# Altium project ESP8266-07.PrjPcb
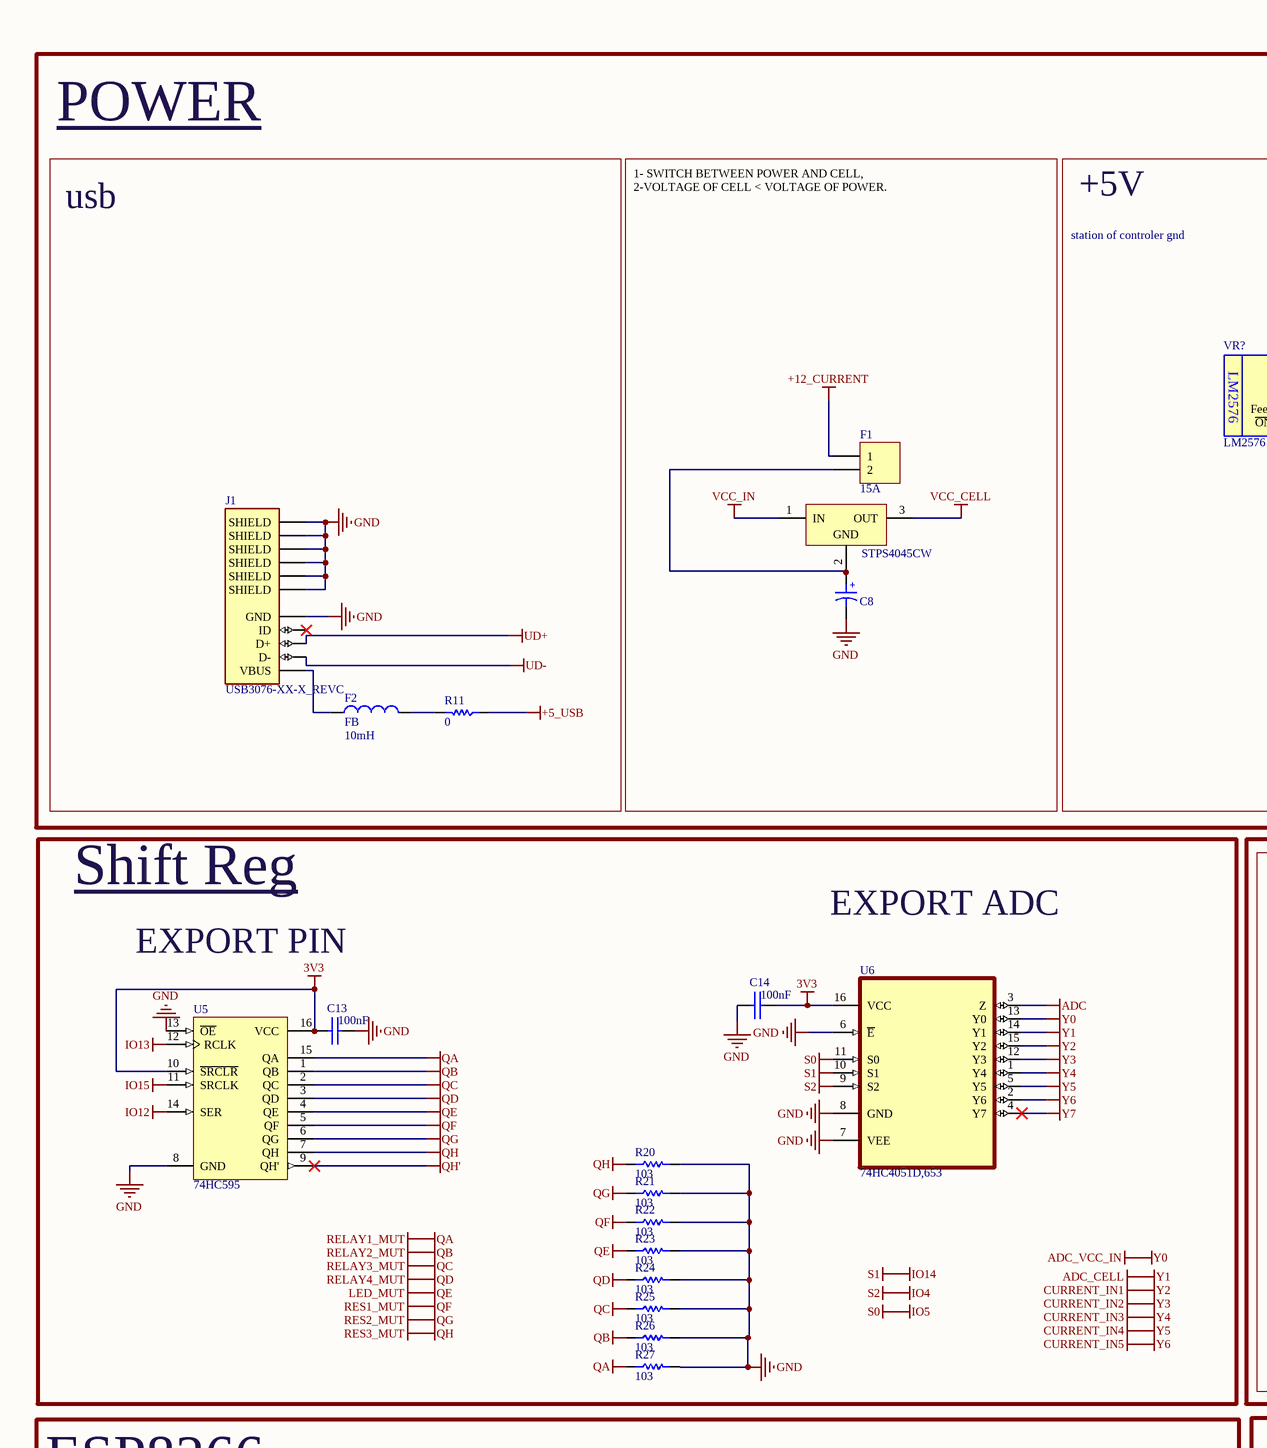
[diagram p0: ESP8266-07.SchDoc, top left]
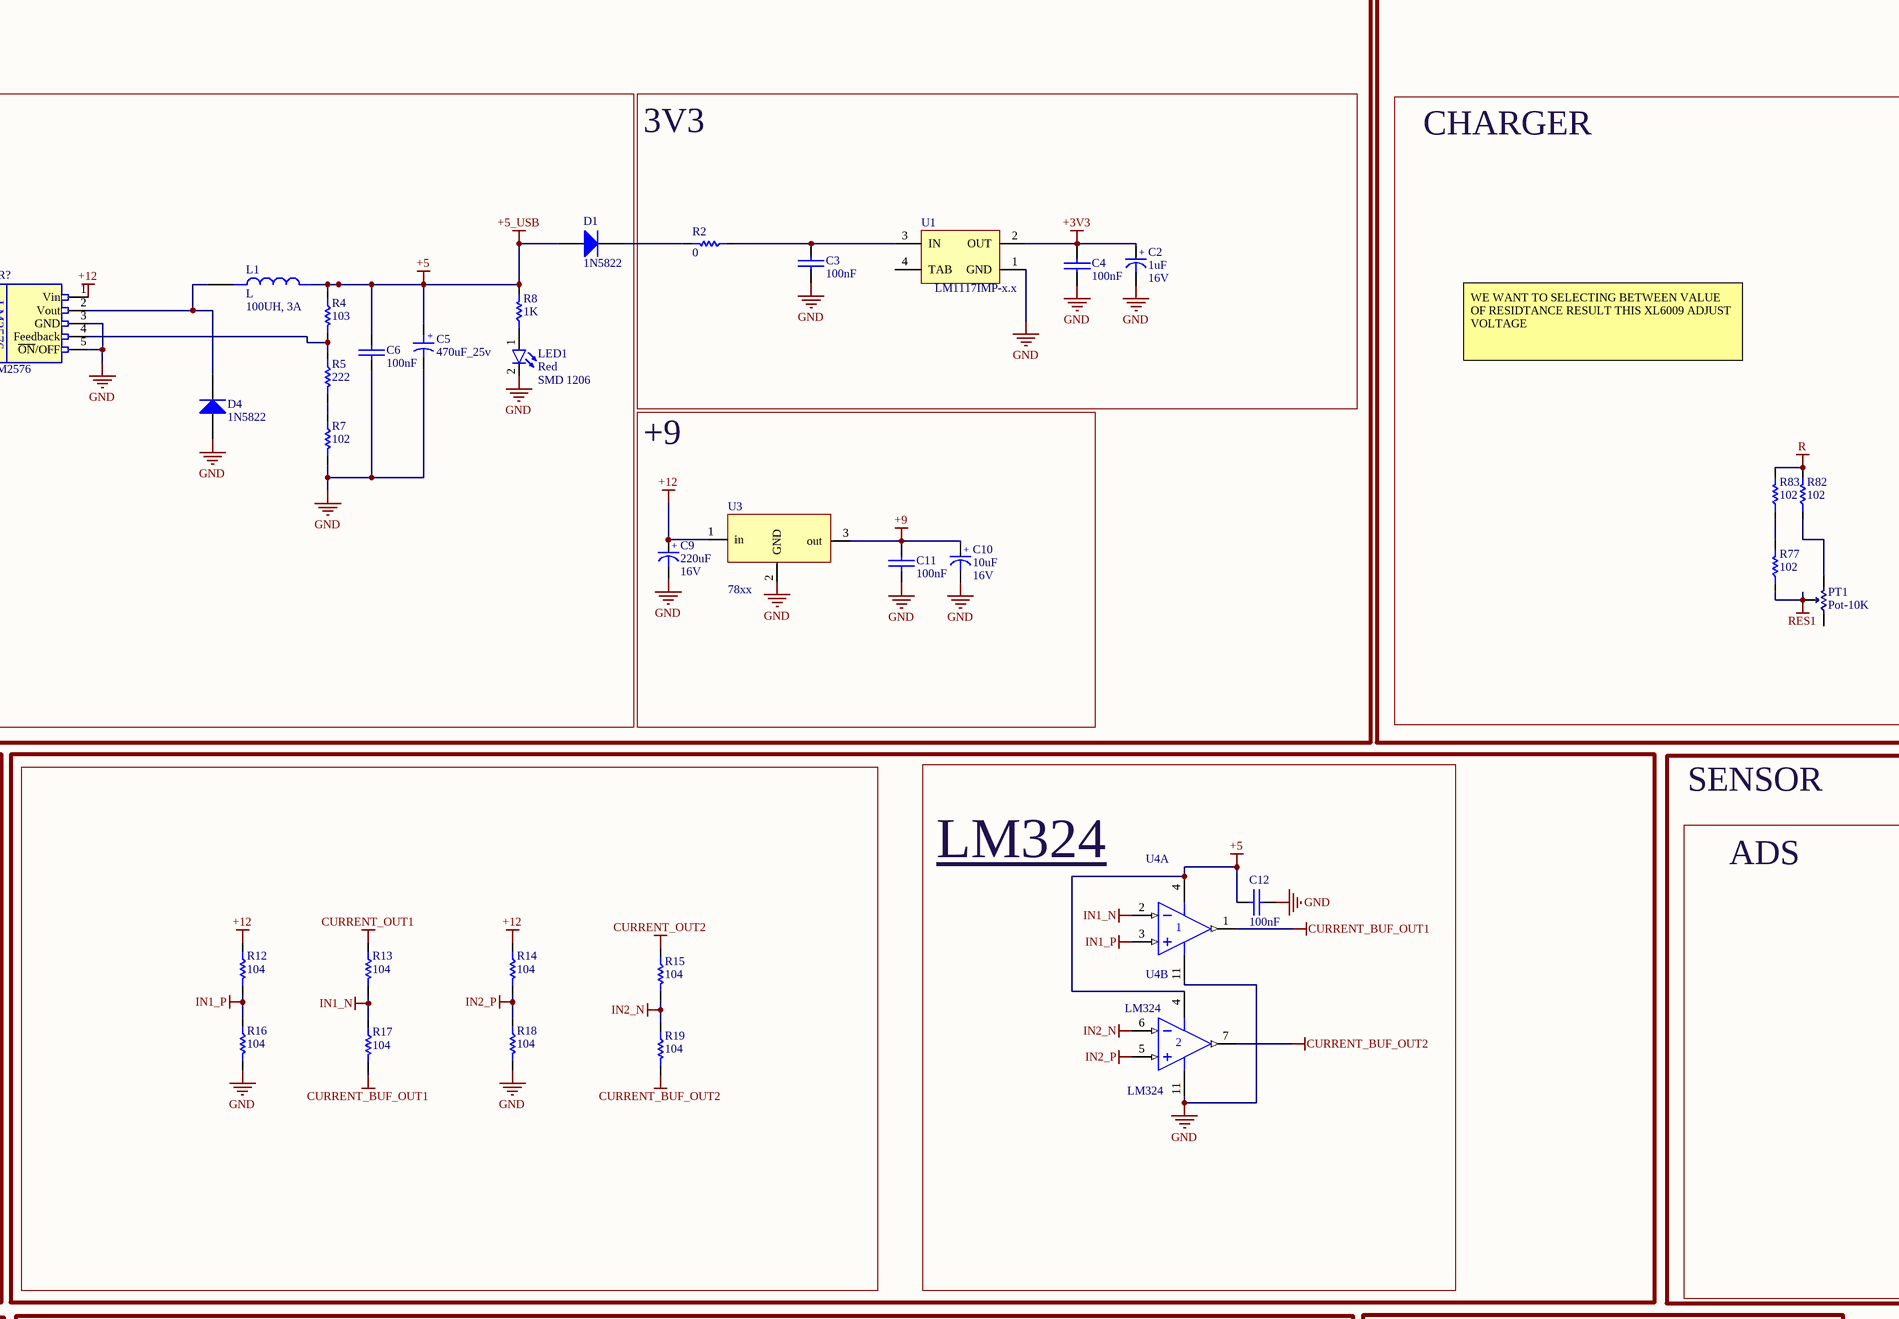
[diagram p1: ESP8266-07.SchDoc, top middle]
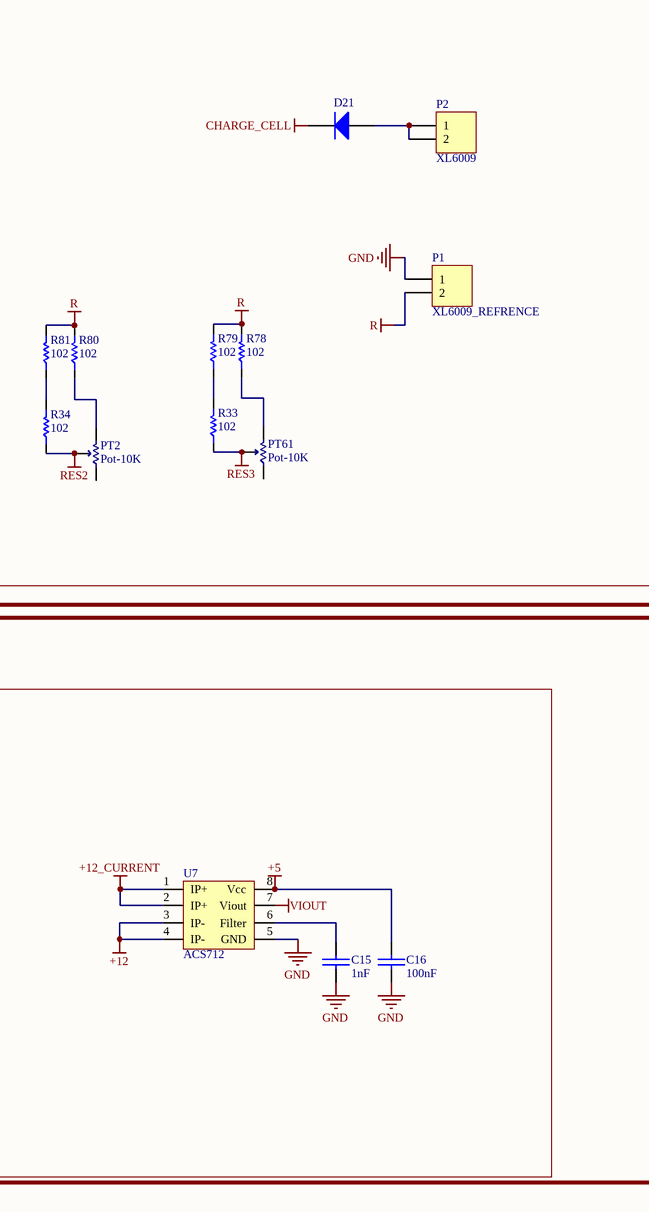
[diagram p2: ESP8266-07.SchDoc, top right]
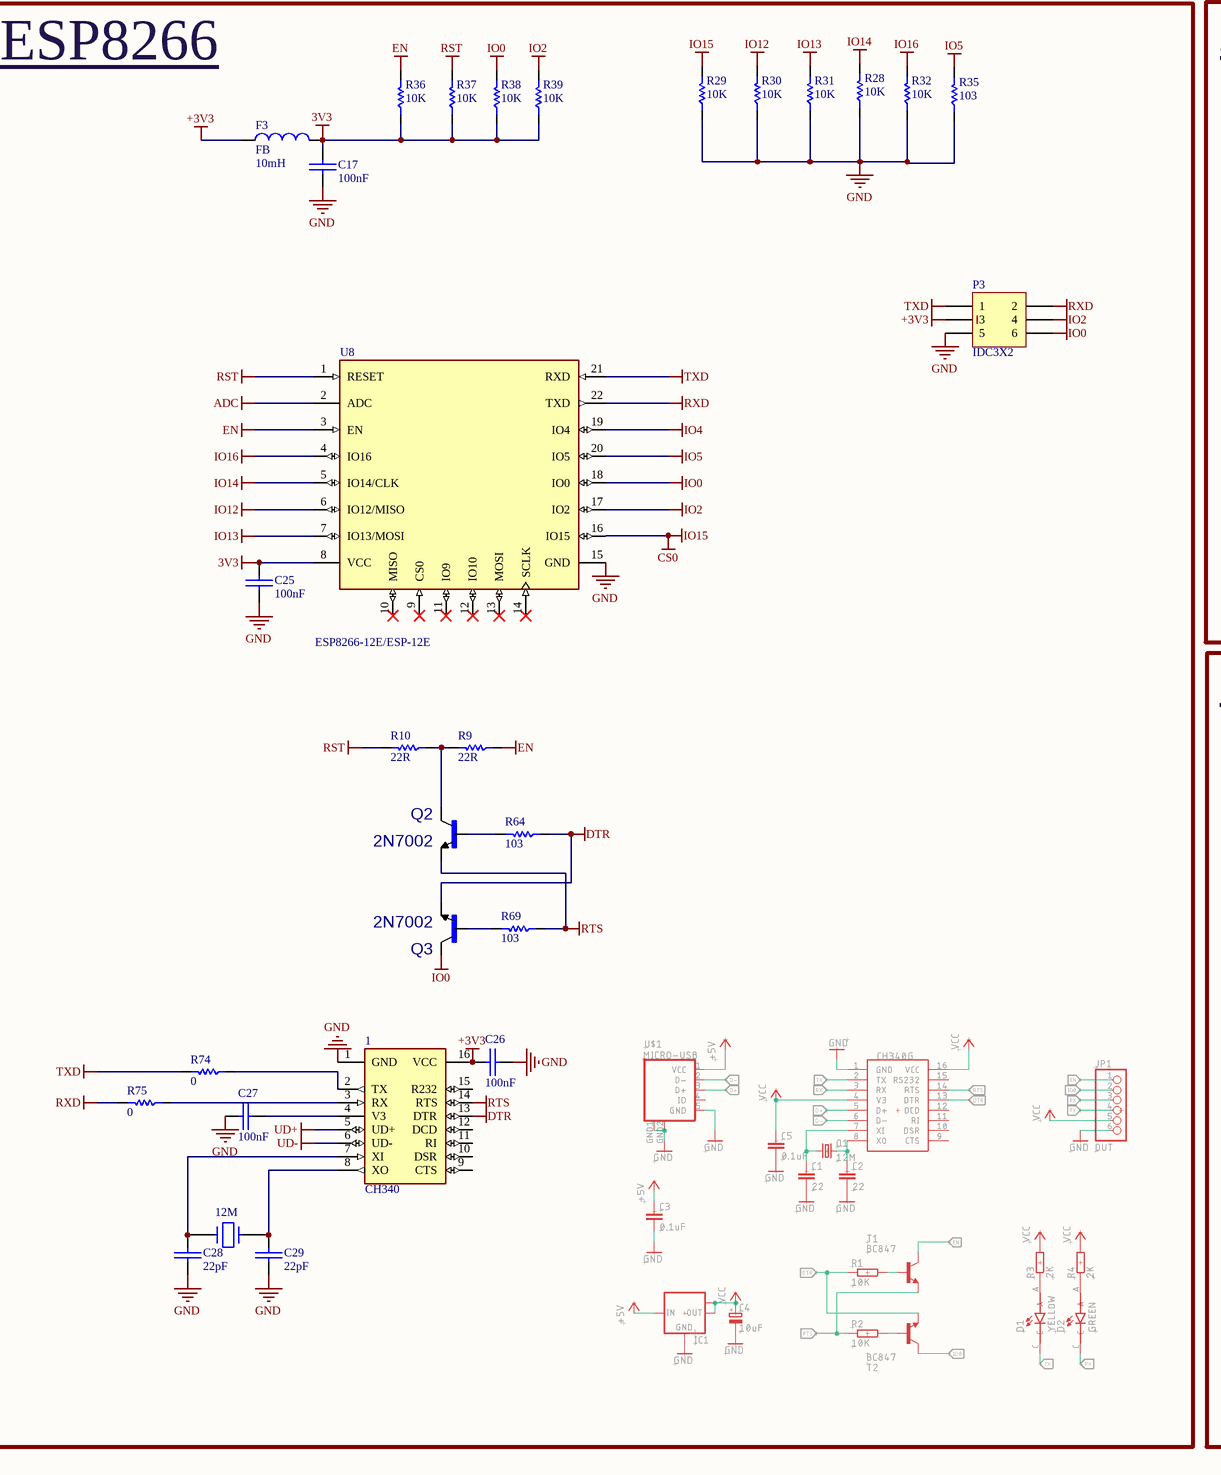
[diagram p3: ESP8266-07.SchDoc, bottom left]
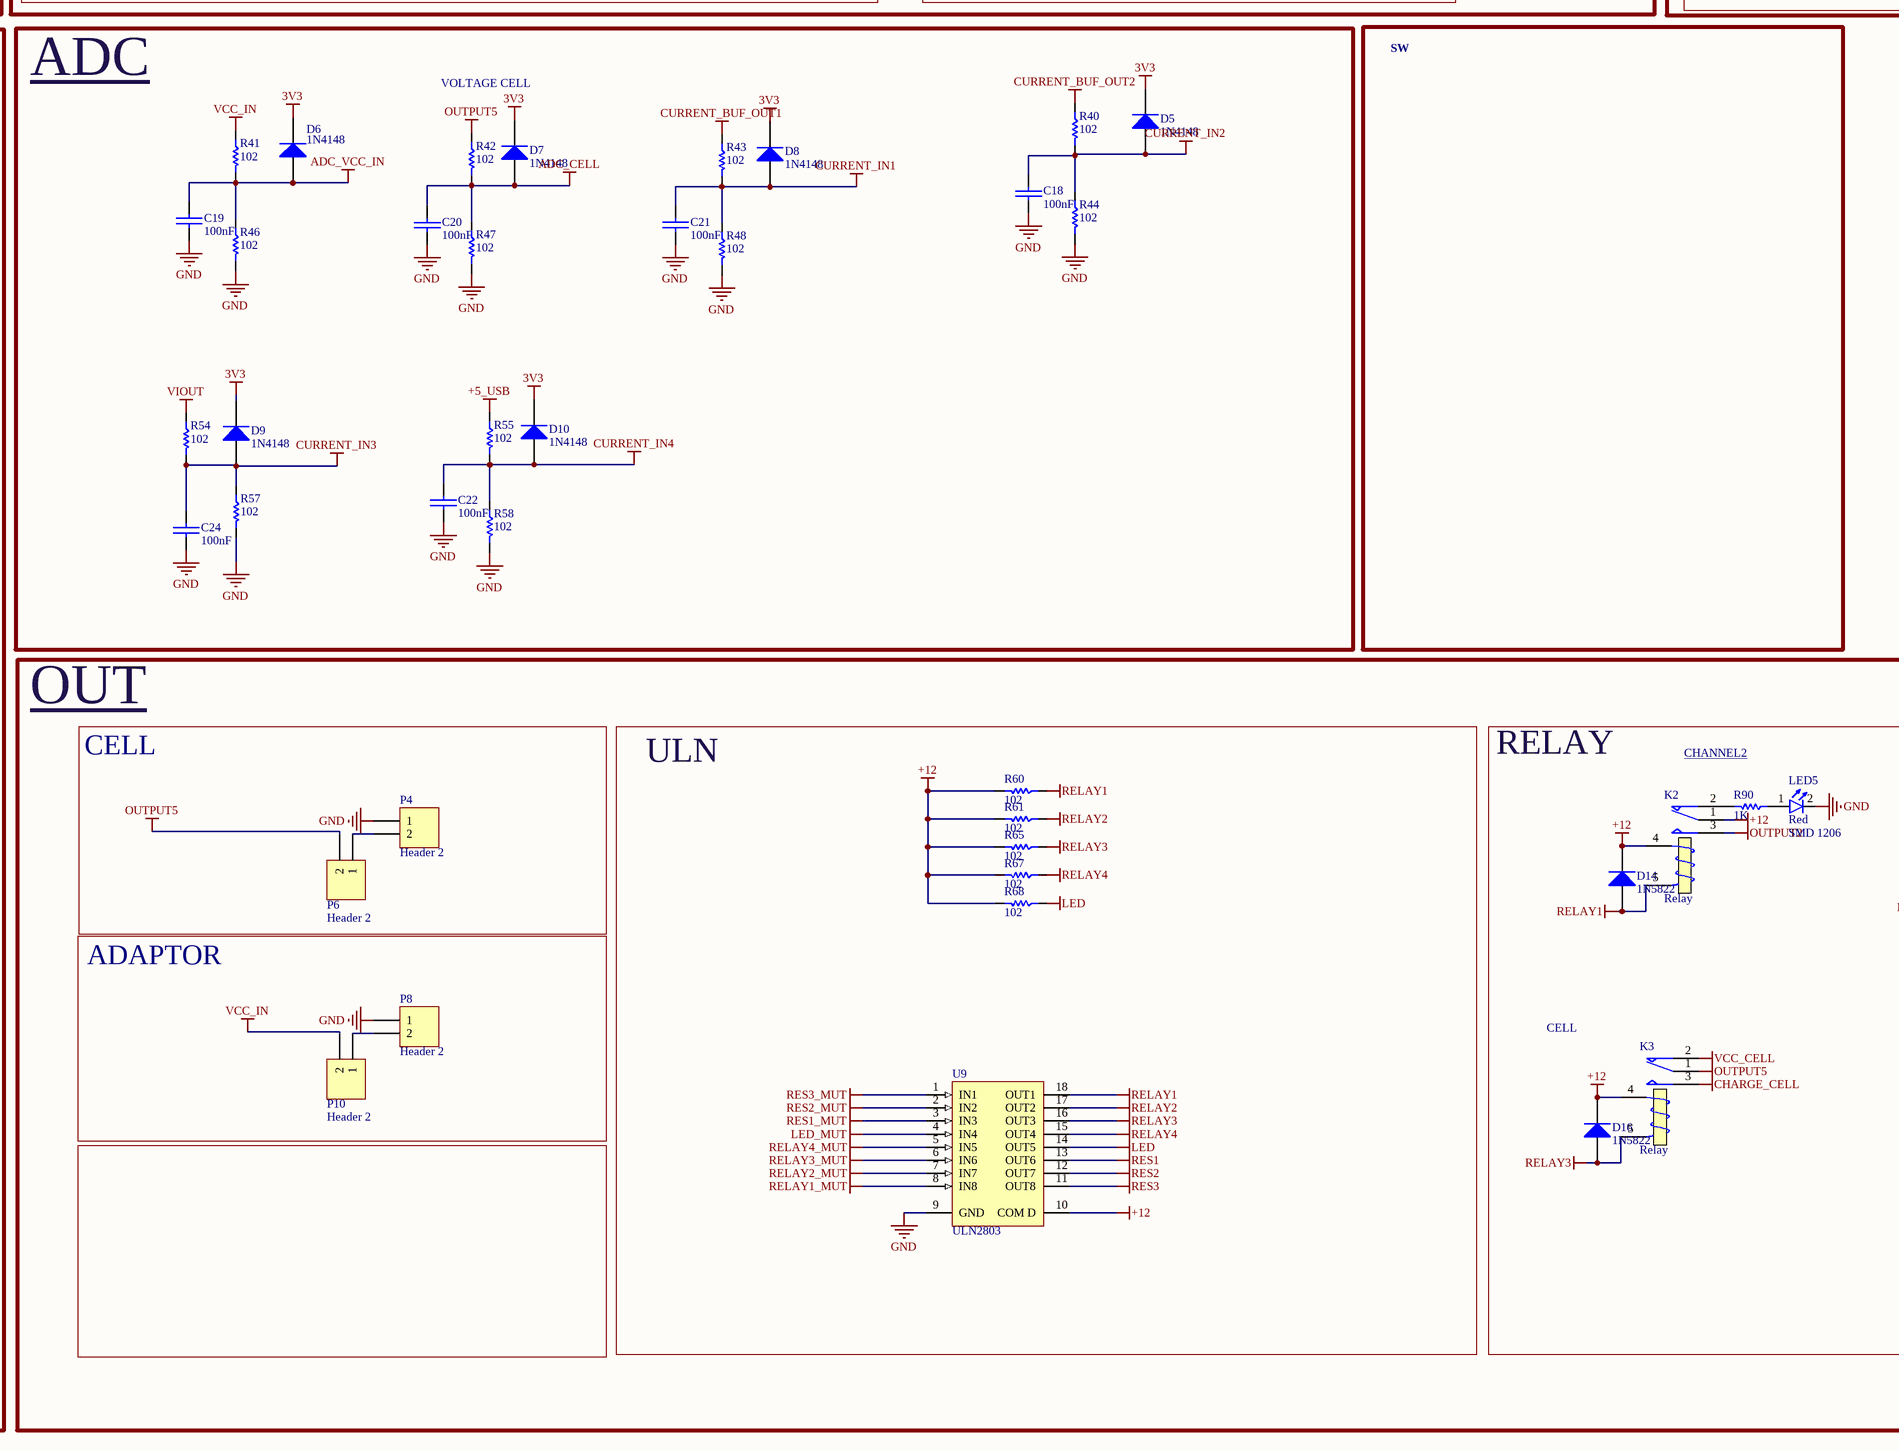
[diagram p4: ESP8266-07.SchDoc, bottom middle]
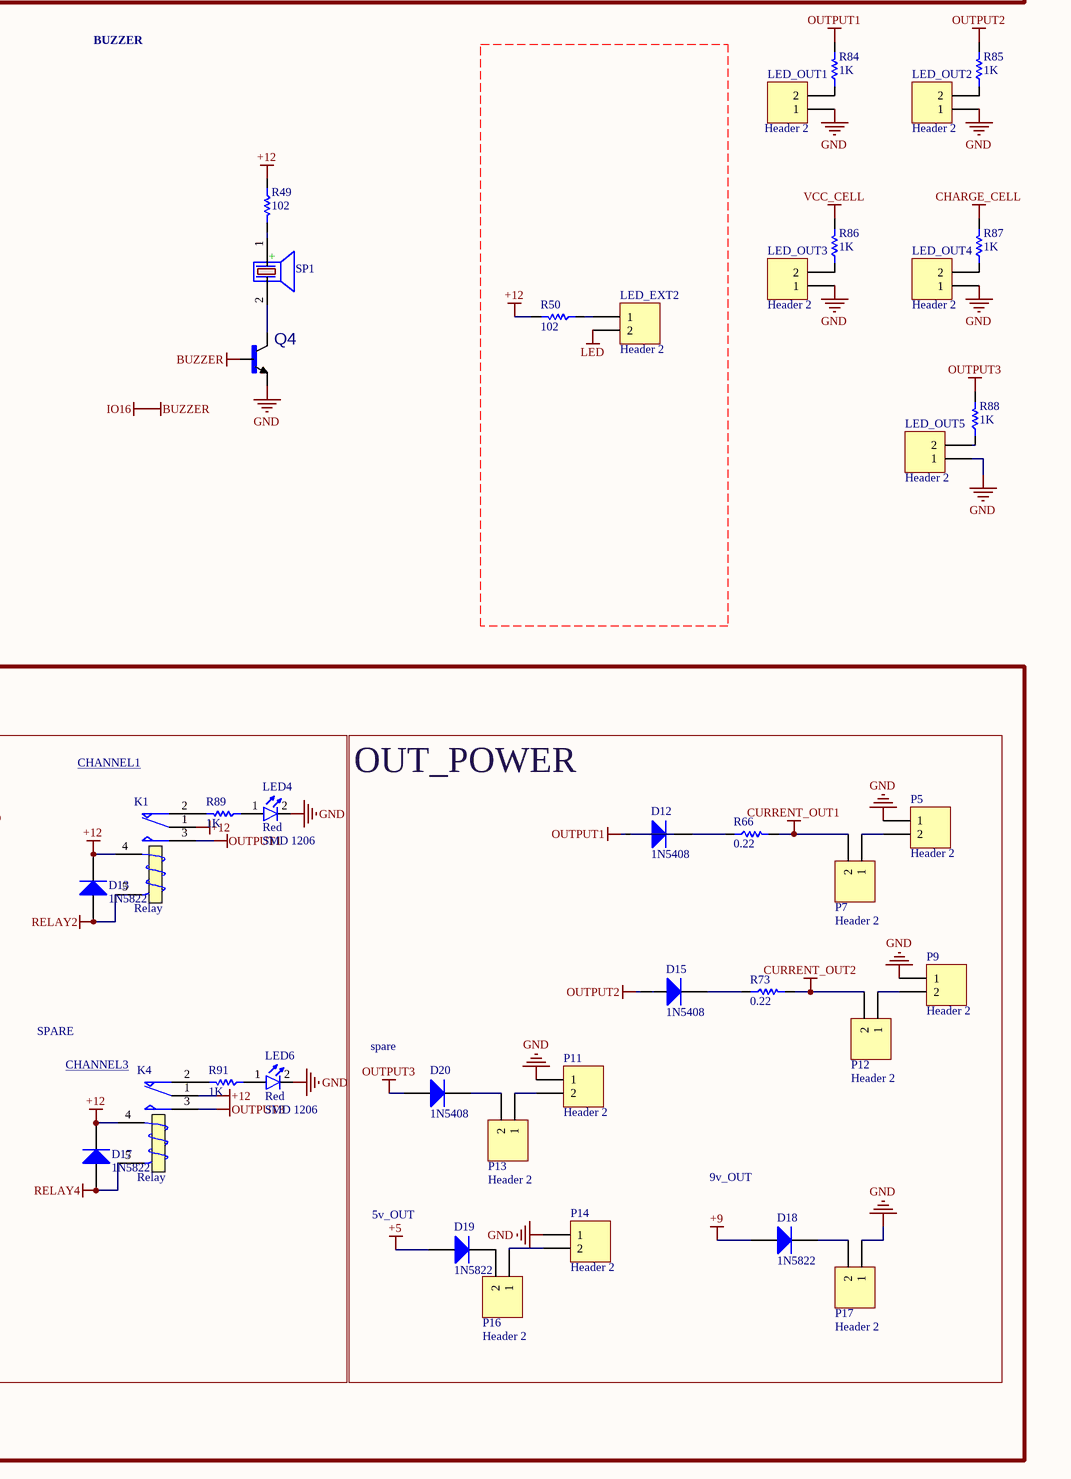
[diagram p5: ESP8266-07.SchDoc, bottom right]
1 sheet, 174 parts. Net scope: global (net labels, ports and power ports of the same name join across sheets).
Board file: ESP8266-07.PcbDoc

## Sheet ESP8266-07.SchDoc
size A1; SheetNumber: 1; SheetTotal: 1

### Parts
1  CH340  [SOIC16]
C2  Voltage: 16V  [cap 01]  (hidden comment: 1uF)
C3  100nF  [SMD_CAP_0805]
C4  100nF  [SMD_CAP_0805]
C5  470uF_25v  [Cap electrolitic radial 8x12-3.5]
C6  100nF  [SMD_CAP_0805]
C8  2000uF_25v  [Cap electrolitic radial 10x20-5]  (value not drawn)
C9  Voltage: 16V  [cap 03]  (hidden comment: 220uF)
C10  Voltage: 16V  [cap 01]  (hidden comment: 10uF)
C11  100nF  [SMD_CAP_0805]
C12  100nF  [SMD_CAP_0805]
C13  100nF  [SMD_CAP_0805]
C14  100nF  [SMD_CAP_0805]
C15  1nF  [SMD_CAP_0805]
C16  100nF  [SMD_CAP_0805]
C17  100nF  [SMD_CAP_0805]
C18  100nF  [SMD_CAP_0805]
C19  100nF  [SMD_CAP_0805]
C20  100nF  [SMD_CAP_0805]
C21  100nF  [SMD_CAP_0805]
C22  100nF  [SMD_CAP_0805]
C24  100nF  [SMD_CAP_0805]
C25  100nF  [SMD_CAP_0805]
C26  100nF  [SMD_CAP_0805]
C27  100nF  [SMD_CAP_0805]
C28  22pF  [SMD_CAP_0805]
C29  22pF  [SMD_CAP_0805]
crystl1  12M  [Crystal SMD]
D1  1N5822  [Diode 1N4007 SMD]
D4  1N5822  [Diode 1N4007 SMD]
D5  1N4148  [LL4148]
D6  1N4148  [LL4148]
D7  1N4148  [LL4148]
D8  1N4148  [LL4148]
D9  1N4148  [LL4148]
D10  1N4148  [LL4148]
D12  1N5408  [Diode 1N5819]
D13  1N5822  [Diode 1N4007 SMD]
D14  1N5822  [Diode 1N4007 SMD]
D15  1N5408  [Diode 1N5819]
D16  1N5822  [Diode 1N4007 SMD]
D17  1N5822  [Diode 1N4007 SMD]
D18  1N5822  [Diode 1N4007 SMD]
D19  1N5822  [Diode 1N4007 SMD]
D20  1N5408  [Diode 1N5819]
D21  (no value)  [Diode 1N5819]
F1  15A  [HDR1X2]
F2  FB  value 10mH  [FB1206]
F3  FB  value 10mH  [FB1206]
J1  USB3076-XX-X_REVC  [GCT_USB3076-XX-X_REVC]
K1  Relay  [Relay 15.40x12.10x13.10]
K2  Relay  [Relay 15.40x12.10x13.10]
K3  Relay  [Relay 15.40x12.10x13.10]
K4  Relay  [Relay 15.40x12.10x13.10]
L1  L  value 100UH, 3A  [Toroidal Inductor Coil]
LED1  Size: SMD 1206  [LED SMD 1206]  (hidden comment: Red)
LED4  Color: Red  Size: SMD 1206  [LED SMD 1206]
LED5  Color: Red  Size: SMD 1206  [LED SMD 1206]
LED6  Color: Red  Size: SMD 1206  [LED SMD 1206]
LED_EXT2  Header 2  [HDR1X2]
LED_OUT1  Header 2  [HDR1X2]
LED_OUT2  Header 2  [HDR1X2]
LED_OUT3  Header 2  [HDR1X2]
LED_OUT4  Header 2  [HDR1X2]
LED_OUT5  Header 2  [HDR1X2]
P1  XL6009_REFRENCE  [HDR1X2]
P2  XL6009  [HDR1X2]
P3  IDC3X2  [IDC_2X3]
P4  Header 2  [HDR1X2]
P5  Header 2  [HDR1X2]
P6  Header 2  [HDR1X2]
P7  Header 2  [HDR1X2]
P8  Header 2  [HDR1X2]
P9  Header 2  [HDR1X2]
P10  Header 2  [HDR1X2]
P11  Header 2  [HDR1X2]
P12  Header 2  [HDR1X2]
P13  Header 2  [HDR1X2]
P14  Header 2  [HDR1X2]
P16  Header 2  [HDR1X2]
P17  Header 2  [HDR1X2]
PT1  Pot-10K  [Square]
PT2  Pot-10K  [Square]
PT61  Pot-10K  [Square]
Q2  2N7002  [SOT23_BEC_M]
Q3  2N7002  [SOT23_BEC_M]
Q4  (no value)  [SOT23_BEC_M]
R2  0  [RES 0805 (2012X06L)]
R4  103  [RES 0805 (2012X06L)]
R5  222  [RES 0805 (2012X06L)]
R7  102  [RES 0805 (2012X06L)]
R8  1K  [RES 0805 (2012X06L)]
R9  22R  [RES 0805 (2012X06L)]
R10  22R  [RES 0805 (2012X06L)]
R11  0  [RES 0805 (2012X06L)]
R12  104  [RES 0805 (2012X06L)]
R13  104  [RES 0805 (2012X06L)]
R14  104  [RES 0805 (2012X06L)]
R15  104  [RES 0805 (2012X06L)]
R16  104  [RES 0805 (2012X06L)]
R17  104  [RES 0805 (2012X06L)]
R18  104  [RES 0805 (2012X06L)]
R19  104  [RES 0805 (2012X06L)]
R20  value 103  [RES 0805 (2012X06L)]  (hidden comment: 102)
R21  103  [RES 0805 (2012X06L)]
R22  103  [RES 0805 (2012X06L)]
R23  103  [RES 0805 (2012X06L)]
R24  103  [RES 0805 (2012X06L)]
R25  103  [RES 0805 (2012X06L)]
R26  103  [RES 0805 (2012X06L)]
R27  103  [RES 0805 (2012X06L)]
R28  10K  [RES 0805 (2012X06L)]
R29  10K  [RES 0805 (2012X06L)]
R30  10K  [RES 0805 (2012X06L)]
R31  10K  [RES 0805 (2012X06L)]
R32  10K  [RES 0805 (2012X06L)]
R33  102  [RES 0805 (2012X06L)]
R34  102  [RES 0805 (2012X06L)]
R35  103  [RES 0805 (2012X06L)]
R36  10K  [RES 0805 (2012X06L)]
R37  10K  [RES 0805 (2012X06L)]
R38  10K  [RES 0805 (2012X06L)]
R39  10K  [RES 0805 (2012X06L)]
R40  102  [RES 0805 (2012X06L)]
R41  102  [RES 0805 (2012X06L)]
R42  102  [RES 0805 (2012X06L)]
R43  102  [RES 0805 (2012X06L)]
R44  102  [RES 0805 (2012X06L)]
R46  102  [RES 0805 (2012X06L)]
R47  102  [RES 0805 (2012X06L)]
R48  102  [RES 0805 (2012X06L)]
R49  102  [RES 0805 (2012X06L)]
R50  102  [RES 0805 (2012X06L)]
R54  102  [RES 0805 (2012X06L)]
R55  102  [RES 0805 (2012X06L)]
R57  102  [RES 0805 (2012X06L)]
R58  102  [RES 0805 (2012X06L)]
R60  102  [RES 0805 (2012X06L)]
R61  102  [RES 0805 (2012X06L)]
R64  103  [RES 0805 (2012X06L)]
R65  102  [RES 0805 (2012X06L)]
R66  0.22  [Res-(5/1)-Stand]
R67  102  [RES 0805 (2012X06L)]
R68  102  [RES 0805 (2012X06L)]
R69  103  [RES 0805 (2012X06L)]
R73  0.22  [Res-(5/1)-Stand]
R74  0  [RES 0805 (2012X06L)]
R75  0  [RES 0805 (2012X06L)]
R77  value 102  [RES 0805 (2012X06L)]
R78  value 102  [RES 0805 (2012X06L)]
R79  value 102  [RES 0805 (2012X06L)]
R80  value 102  [RES 0805 (2012X06L)]
R81  value 102  [RES 0805 (2012X06L)]
R82  value 102  [RES 0805 (2012X06L)]
R83  value 102  [RES 0805 (2012X06L)]
R84  value 1K  [RES 0805 (2012X06L)]
R85  value 1K  [RES 0805 (2012X06L)]
R86  value 1K  [RES 0805 (2012X06L)]
R87  value 1K  [RES 0805 (2012X06L)]
R88  value 1K  [RES 0805 (2012X06L)]
R89  value 1K  [RES 0805 (2012X06L)]
R90  value 1K  [RES 0805 (2012X06L)]
R91  value 1K  [RES 0805 (2012X06L)]
SP1  (no value)  [BUZZER 7.62mm DC]
STPS4045CW  (no value)  [TO-220]
U1  LM1117IMP-x.x  [MP04A_N]
U3  78xx  [To-220]
U4  LM324  [SO-14]  (parts A,B of 4)
U5  74HC595  [SO16_N]
U6  74HC4051D,653  [SOIC127P600X175-16N]
U7  ACS712  [ACS712]
U8  ESP8266-12E/ESP-12E  [XCVR_ESP8266-12E/ESP-12E]
U9  ULN2803  [SOW-18]
VR?  LM2576  [TO-220-5]

### Blocks framed on the sheet
POWER: C8 F1 STPS4045CW
usb: F2 J1 R11
+5V: C5 C6 D1 D4 L1 LED1 R4 R5 R7 R8 VR?
3V3: C2-C4 R2 U1
CHARGER: D21 P1 P2 PT1 PT2 PT61 R33 R34 R77-R83
+9: C9-C11 U3
Shift Reg: C13 C14 R20-R27 U5 U6
LM324: C12 U4
ADS: C15 C16 U7
ESP8266: 1 C17 C25-C29 crystl1 F3 P3 Q2 Q3 R9 R10 R28-R32 R35-R39 R64 R69 R74 R75 U8
ADC: C18-C22 C24 D5-D10 R40-R44 R46-R48 R54 R55 R57 R58
CELL: P4 P6
ULN: R60 R61 R65 R67 R68 U9
RELAY: D13 D14 D16 D17 K1-K4 LED4-LED6 R89-R91
OUT_POWER: D12 D15 D18-D20 P5 P7 P9 P11-P14 P16 P17 R66 R73
ADAPTOR: P8 P10

### Nets
3V3: C13.1(+) C14.2(-) C17.1(+) C25.1(+) D5.2(K) D6.2(K) D7.2(K) D8.2(K) D9.2(K) D10.2(K) F3.2 R36.1 R37.1 R38.1 R39.1 U5.10(~{SRCLR}) U5.16(VCC) U6.16(VCC) U8.8(VCC)
+3V3: 1.16(VCC) C2.1(+) C4.1(+) C26.1(+) F3.1 P3.3 U1.2(OUT)
+5: C5.1 C6.1(+) C12.1(+) C16.1(+) D1.1(A) D19.1(A) L1.2 R4.1 R8.2 R11.1 R55.1 U4.4(V+) U7.8(Vcc)  [also labelled +5_USB]
+9: C10.1(+) C11.1(+) D18.1(A) U3.3(out)
+12: C9.1(+) D13.2(K) D14.2(K) D16.2(K) D17.2(K) K1.1(COM) K1.4(T1) K2.1(COM) K2.4(T1) K3.4(T1) K4.1(COM) K4.4(T1) R12.1 R14.1 R49.1 R50.2 R60.2 R61.2 R65.2 R67.2 R68.2 U3.1(in) U7.3(IP-) U7.4(IP-) U9.10(COM_D) VR?.1(Vin)
+12_CURRENT: F1.1 U7.1(IP+) U7.2(IP+)
ADC: U6.3(Z) U8.2(ADC)
ADC_CELL: C20.1(+) D7.1(A) R42.2 R47.1 U6.14(Y1)  [also labelled Y1]
ADC_VCC_IN: C19.1(+) D6.1(A) R41.2 R46.1 U6.13(Y0)  [also labelled Y0]
BUZZER: Q4.1(B) R32.2 U8.4(IO16)  [also labelled IO16]
CHARGE_CELL: D21.2(K) K3.3(NO) R87.2
CS0: R29.2 U5.11(SRCLK) U8.16(IO15)  [also labelled IO15]
CURRENT_BUF_OUT1: R17.2 R43.1 U4.1(OUT)
CURRENT_BUF_OUT2: R19.2 R40.1 U4.7(OUT)
CURRENT_IN1: C21.1(+) D8.1(A) R43.2 R48.1 U6.15(Y2)  [also labelled Y2]
CURRENT_IN2: C18.1(+) D5.1(A) R40.2 R44.1 U6.12(Y3)  [also labelled Y3]
CURRENT_IN3: C24.1(+) D9.1(A) R54.2 R57.1 U6.1(Y4)  [also labelled Y4]
CURRENT_IN4: C22.1(+) D10.1(A) R55.2 R58.1 U6.5(Y5)  [also labelled Y5]
CURRENT_IN5: U6.2(Y6)  [also labelled Y6]
CURRENT_OUT1: P7.2 R13.1 R66.2
CURRENT_OUT2: P12.2 R15.1 R73.2
DTR: 1.13(DTR) Q3.2(E) R64.1
EN: R9.1 R36.2 U8.3(EN)
GND: 1.1(GND) C2.2(-) C3.2(-) C4.2(-) C5.2 C6.2(-) C8.2 C9.2(-) C10.2(-) C11.2(-) C12.2(-) C13.2(-) C14.1(+) C15.2(-) C16.2(-) C17.2(-) C18.2(-) C19.2(-) C20.2(-) C21.2(-) C22.2(-) C24.2(-) C25.2(-) C26.2(-) C27.1(+) C28.2(-) C29.2(-) D4.1(A) J1.5(GND) J1.6(SHIELD) J1.7(SHIELD) J1.8(SHIELD) J1.9(SHIELD) J1.10(SHIELD) J1.11(SHIELD) LED1.2(K) LED4.2(K) LED5.2(K) LED6.2(K) LED_OUT1.1 LED_OUT2.1 LED_OUT3.1 LED_OUT4.1 LED_OUT5.1 P1.1 P3.5 P4.1 P5.1 P8.1 P9.1 P11.1 P14.1 P17.1 Q4.2(E) R7.2 R16.2 R18.2 R20.2 R21.2 R22.2 R23.2 R24.2 R25.2 R26.2 R27.2 R28.1 R29.1 R30.1 R31.1 R32.1 R35.1 R44.2 R46.2 R47.2 R48.2 R57.2 R58.2 U1.1(GND) U3.2(GND) U4.11(V-) U5.8(GND) U5.13(~{OE}) U6.6(~{E}) U6.7(VEE) U6.8(GND) U7.5(GND) U8.15(GND) U9.9(GND) VR?.3(GND) VR?.5(~{ON}/OFF)
IN1_N: R13.2 R17.1 U4.2(IN-)
IN1_P: R12.2 R16.1 U4.3(IN+)
IN2_N: R15.2 R19.1 U4.6(IN-)
IN2_P: R14.2 R18.1 U4.5(IN+)
IO0: P3.6 Q3.3(C) R38.2 U8.18(IO0)
IO2: P3.4 R39.2 U8.17(IO2)
IO4: U6.9(S2) U8.19(IO4)  [also labelled S2]
IO5: R35.2 U6.11(S0) U8.20(IO5)  [also labelled S0]
IO12: R30.2 U5.14(SER) U8.6(IO12/MISO)
IO13: R31.2 U5.12(RCLK) U8.7(IO13/MOSI)
IO14: R28.2 U6.10(S1) U8.5(IO14/CLK)  [also labelled S1]
LED: LED_EXT2.2 R68.1 U9.14(OUT5)
LED_MUT: R23.1 U5.4(QE) U9.4(IN4)  [also labelled QE]
OUTPUT1: D12.1(A) K1.3(NO) R84.2
OUTPUT2: D15.1(A) K2.3(NO) R85.2
OUTPUT3: D20.1(A) K4.3(NO) R88.2
OUTPUT5: K3.1(COM) P6.2 R42.1
QA: R27.1 U5.15(QA) U9.8(IN8)  [also labelled RELAY1_MUT]
QB: R26.1 U5.1(QB) U9.7(IN7)  [also labelled RELAY2_MUT]
QC: R25.1 U5.2(QC) U9.6(IN6)  [also labelled RELAY3_MUT]
QD: R24.1 U5.3(QD) U9.5(IN5)  [also labelled RELAY4_MUT]
QF: R22.1 U5.5(QF) U9.3(IN3)  [also labelled RES1_MUT]
QG: R21.1 U5.6(QG) U9.2(IN2)  [also labelled RES2_MUT]
QH: R20.1 U5.7(QH) U9.1(IN1)  [also labelled RES3_MUT]
QH': U5.9(QH')
R: P1.2 R78.2 R79.2 R80.2 R81.2 R82.2 R83.2
RELAY1: D14.1(A) K2.5(T2) R60.1 U9.18(OUT1)
RELAY2: D13.1(A) K1.5(T2) R61.1 U9.17(OUT2)
RELAY3: D16.1(A) K3.5(T2) R65.1 U9.16(OUT3)
RELAY4: D17.1(A) K4.5(T2) R67.1 U9.15(OUT4)
RES1: PT1.2 R77.1 U9.13(OUT6)
RES2: PT2.2 R34.1 U9.12(OUT7)
RES3: PT61.2 R33.1 U9.11(OUT8)
RST: R10.2 R37.2 U8.1(RESET)
RTS: 1.14(RTS) Q2.2(E) R69.1
RXD: P3.2 R75.2 U8.22(TXD)
TXD: P3.1 R74.2 U8.21(RXD)
UD+: 1.5(UD+) J1.3(D+)
UD-: 1.6(UD-) J1.2(D-)
VCC_CELL: K3.2(NC) R86.2 STPS4045CW.3(OUT)
VCC_IN: P10.2 R41.1 STPS4045CW.1(IN)
VIOUT: R54.1 U7.7(Viout)
Y7: U6.4(Y7)
Net1_2: 1.2(TX) R74.1
Net1_3: 1.3(RX) R75.1
Net1_4: 1.4(V3) C27.2(-)
Net1_7: 1.7(XI) C28.1(+) crystl1.1
Net1_8: 1.8(XO) C29.1(+) crystl1.2
NetC3_1: C3.1(+) R2.1 U1.3(IN)
NetC8_1: C8.1 F1.2 STPS4045CW.2(GND)
NetC15_1: C15.1(+) U7.6(Filter)
NetD1_2: D1.2(K) R2.2
NetD4_2: D4.2(K) L1.1 VR?.2(Vout)
NetD12_2: D12.2(K) R66.1
NetD15_2: D15.2(K) R73.1
NetD18_2: D18.2(K) P17.2
NetD19_2: D19.2(K) P16.2
NetD20_2: D20.2(K) P13.2
NetD21_1: D21.1(A) P2.1 P2.2
NetF2_1: F2.1 J1.1(VBUS)
NetF2_2: F2.2 R11.2
NetK1_2: K1.2(NC) R89.2
NetK2_2: K2.2(NC) R90.2
NetK4_2: K4.2(NC) R91.2
NetLED1_1: LED1.1(A) R8.1
NetLED4_1: LED4.1(A) R89.1
NetLED5_1: LED5.1(A) R90.1
NetLED6_1: LED6.1(A) R91.1
NetLED_EXT2_1: LED_EXT2.1 R50.1
NetLED_OUT1_2: LED_OUT1.2 R84.1
NetLED_OUT2_2: LED_OUT2.2 R85.1
NetLED_OUT3_2: LED_OUT3.2 R86.1
NetLED_OUT4_2: LED_OUT4.2 R87.1
NetLED_OUT5_2: LED_OUT5.2 R88.1
NetP4_2: P4.2 P6.1
NetP5_2: P5.2 P7.1
NetP8_2: P8.2 P10.1
NetP9_2: P9.2 P12.1
NetP11_2: P11.2 P13.1
NetP14_2: P14.2 P16.1
NetPT1_3: PT1.3 R82.1
NetPT2_3: PT2.3 R80.1
NetPT61_3: PT61.3 R78.1
NetQ2_1: Q2.1(B) R64.2
NetQ2_3: Q2.3(C) R9.2 R10.1
NetQ3_1: Q3.1(B) R69.2
NetQ4_3: Q4.3(C) SP1.2(-)
NetR4_2: R4.2 R5.1 VR?.4(Feedback)
NetR5_2: R5.2 R7.1
NetR33_2: R33.2 R79.1
NetR34_2: R34.2 R81.1
NetR49_2: R49.2 SP1.1(+)
NetR77_2: R77.2 R83.1

Not connected (* = marked no-connect by the designer): 1 9(CTS) 10(DSR) 11(RI) 12(DCD) 15(R232); J1 4(ID)*; PT1 1; PT2 1; PT61 1; U1 4(TAB); U8 9(CS0)* 10(MISO)* 11(IO9)* 12(IO10)* 13(MOSI)* 14(SCLK)*

### Notes on the sheet
- 1- SWITCH BETWEEN POWER AND CELL,
  2-VOLTAGE OF CELL < VOLTAGE OF POWER.
- station of controler gnd
- WE WANT TO SELECTING BETWEEN VALUE OF RESIDTANCE RESULT THIS XL6009 ADJUST VOLTAGE
- SENSOR
- EXPORT PIN
- EXPORT ADC
- VOLTAGE CELL
- SW
- BUZZER
- OUT
- CHANNEL2
- (near K1) CHANNEL1
- SPARE
- CELL
- (near K4) CHANNEL3
- (near D20) spare
- 5v_OUT
- 9v_OUT
- (in symbol Cap electrolitic radial 10x21) +

### Library data of the parts
1 = CH340: Circuit Breaker Magnetic 3Pole 40A 240VAC; MF: Eaton; Availability: Unavailable; Price: None; Package: None; Value: *; SnapEDA_Link: https://www.snapeda.com/parts/CH340/Eaton/view-part/4701946/?ref=snap; MP: CH340
C2 C9 C10 = Cap-Polar: Polar Capacitor; Designer: Saeid Jorablo; Organazation: ControTec; Adding Date: 1387/12/20
  C2: Value: 1uF
  C9: Value: 220uF
  C10: Value: 10uF
C3 C4 C6 C11-C22 C24-C29 = Cap-Bipolar: Bipolar Capacitor; Voltage: 100V; Designer: Saeid Jorablo; Organazation: ControTec; Adding Date: 1387/12/20
  C3 C4 C6 C11-C14 C16-C22 C24-C27: Value: 100nF
  C15: Value: 1nF
  C28 C29: Value: 22pF
C5 C8 = Cap electrolitic radial 10x21: Cap electrolitic radial; Part. No: 100U/50V; Designer: Abbas Basereh; Data: 16-12-2016
crystl1 = CRYSTAL
D1 D4 D13 D14 D16-D19 = Diode 1N: High Conductance Fast Diode; Published: 8-Jun-2000; LatestRevisionDate: 17-Jul-2002; LatestRevisionNote: Re-released for DXP Platform.; DatasheetDocument: 1997; PackageReference: DO-35; Publisher: Altium Limited; Code_JEDEC: DO-204-AH; ComponentLink1Description: Manufacturer Link; ComponentLink1URL: http://www.fairchildsemi.com/; ComponentLink2Description: Datasheet; ComponentLink2URL: http://www.fairchildsemi.com/ds/1N%2F1N4148.pdf
D5-D10 = Diode 1N4148: High Conductance Fast Diode; Published: 8-Jun-2000; LatestRevisionDate: 17-Jul-2002; LatestRevisionNote: Re-released for DXP Platform.; DatasheetVersion: 1997; PackageReference: DO-35; Publisher: Altium Limited; PackageDescription: Diode, Axial; Body 3.8 x 1.9 mm (LxDia. max), Lead Dia. 0.53 mm (max); Code_JEDEC: DO-204-AH; ComponentLink1Description: Manufacturer Link; ComponentLink1URL: http://www.fairchildsemi.com/; ComponentLink2Description: Datasheet; ComponentLink2URL: http://www.fairchildsemi.com/ds/1N%2F1N4148.pdf
D12 D15 D20 D21 = Diode 1N5408: 3 Amp Medium Power Silicon Rectifier Diode; Published: 8-Jun-2000; LatestRevisionDate: 17-Jul-2002; LatestRevisionNote: Re-released for DXP Platform.; DatasheetVersion: Aug-1984; PackageReference: DO-201AD; Publisher: Altium Limited; PackageDescription: Diode, Axial; Body 9.5 x 5.3 mm (LxDia. max), Lead Dia. 1.32 mm (max); ComponentLink1Description: Manufacturer Link; ComponentLink1URL: http://www.irf.com/
F1 LED_EXT2 LED_OUT1-LED_OUT5 P1 P2 P4-P14 P16 P17 = Header 2: Header, 2-Pin; LatestRevisionDate: 17-Jul-2002; LatestRevisionNote: Re-released for DXP Platform.; Publisher: Altium Limited
F2 F3 = Inductor: Code_IEC: 1005; Published: 8-Jun-2000; LatestRevisionDate: 29-May-2009; LatestRevisionNote: IPC-7351 Footprint Added.; PackageReference: 0402-A; Publisher: Altium Limited; PackageDescription: Chip Inductor; Code_JEITA: 0402
J1 = USB3076-XX-X_REVC: USB - micro B USB 2.0 Receptacle Connector 5 Position Surface Mount, Right Angle; Through Hole; MP: USB3076-30-A; MF: Global Connector Technology; Availability: Unavailable; SnapEDA_Link: https://www.snapeda.com/parts/USB3076-30-A/Global%20Connector%20Technology/view-part/276912/?ref=snap; Package: None; Price: None; Value: *
K1-K4 = RELAY General: Relay_SPDT POWER NEEDLE; Designer: Ali Hafizi; Company: E.P.I.L; Design_Date: 2011/10/31
L1 = Inductor-100uH-3A-Toroidal  Coil: manufacture: CHINA; manufacture p-n: 5026-100UH-3A-0.6MM; LIBRARY PATCH: R_C_D_T.SchLib; Rahkaran: 1010900947; part: Inductor-100uH-3A-Toroidal  Coil; supplier1: javan; supplier1 p-n: TOROID-100UH-3A; Footprint Patch: R_C_D_T.PcbLib
LED1 LED4-LED6 = LED: Designer: Saeid Jorablo; Organazation: ControTec; Adding Date: 1387/12/22
  LED1: Color: Red
P3 = IDC 3X2: IDC, 6-Pin, Dual row; LatestRevisionDate: 17-Jul-2002; LatestRevisionNote: Re-released for DXP Platform.; Publisher: Altium Limited
PT1 PT2 PT61 = resistor-Pot-10K: manufacture: Changzhou Kennon ELectronics; manufacture p-n: WH06-2C-10K; value: 10K; LIBRARY PATCH: R_C_D_T.SchLib; Rahkaran: ‎1012000156; part: resistor-Pot-10K; supplier1: javan; supplier1 p-n: POT 10K; Footprint Patch: R_C_D_T.PcbLib
Q4 = 2N7002: Value: *
R2 R4 R5 R7-R44 R46-R50 R54 R55 R57 R58 R60 R61 R64-R69 R73-R75 R77-R91 = Resistor: Tolerance: 5%; Power: 1/8 W
  R2 R11 R74 R75: Value: 0
  R4 R21-R27 R35 R64 R69: Value: 103
  R5: Value: 222
  R7 R33 R34 R40-R44 R46-R50 R54 R55 R57 R58 R60 R61 R65 R67 R68: Value: 102
  R8: Value: 1K
  R9 R10: Value: 22R
  R12-R19: Value: 104
  R28-R32 R36-R39: Value: 10K
  R66 R73: Value: 0.22
SP1 = PIEZO BUZZER: PIEZO BUZZER ACTIVE; Designer: Abbas Basereh; Comment_1: SPEAKER AND BEEP; Design Date: 1395/11/14; ComponentLink2Description: Reference; PackageDescription: THD; Publisher: Abbas Basereh; Mounting Technology: THD; Pin Count: 2; Status: Unreleased
STPS4045CW = LF33_DIP: manufacture: STMicroelectronics; manufacture p-n: LF33CV; designer: rashid_behdarvand; current: 500mA; voltage: 40V; LIBRARY PATCH: NKH_IC.SchLib; Rahkaran: 1012300091; PackageDescription: D-PAK/TO-252-AA; 3 Leads (1 Cropped); Body 10.1 (inc. leads) x 6.6 mm (LxW max); part: LF33_DIP; case: TO220; supplier1: javan; supplier1 p-n: LF33CV; Footprint Patch: NKH_IC.PcbLib
U1 = LM1117IMP-x.x: x.x Volt, 800mA Low-Dropout Linear Regulator, 4-pin SOT-223; PartNumber: LM1117IMP-3.3; Manufacturer: National Semiconductor; PackageTopMarking: XYTT*N05B; PowerWise: N; CompType: LDO IC; Published: 4-Dec-2008; DatasheetVersion: Apr-2006; PackageVersion: revB, Apr-2003; PackageReference: MP04A; Publisher: Altium Limited; PackageDescription: Molded SOT-223, 6.50 x 3.56 x 1.6mm Body, 4 Lead, 2.3mm Pitch; Supplier 1: Farnell; Supplier Part Number 1: 7614123; RoHS: N; PinCount: 4; Code_JEDEC: TO-261-AA; Code_IPC: SOT223-4; ComponentLink1Description: LM1117 Datasheet; ComponentLink1URL: http://www.national.com/ds/LM/LM1117.pdf; ComponentLink2Description: LM1117 Web Page; ComponentLink2URL: http://www.national.com/pf/LM/LM1117.html; ComponentLink3Description: MP04A Package Page; ComponentLink3URL: http://www.national.com/packaging/folders/mp04a.html
U3 = 7805
U4 = LM324-SMD: Quad Low-Power Operational Amplifier; manufacture: STMicroelectronics; manufacture p-n: LM324DT; PackageDocument: 1991; value: 40 mA; LIBRARY PATCH: NKH_IC.SchLib; Rahkaran: ‎1012300094; Published: 17-Jul-2002; LatestRevisionDate: 06-Jun-2005; LatestRevisionNote: Stylized 3D Model Added.; DatasheetDocument: 1988; PackageReference: 751A-02; Publisher: Altium Limited; ComponentLink1Description: Manufacturer Link; ComponentLink1URL: http://www.onsemi.com/site/products/parametrics/0,4446,251,00.html; ComponentLink2Description: Datasheet; ComponentLink2URL: http://www.onsemi.com/pub/Collateral/LM324-D.PDF; part: LM324-SMD; case: SO-14; supplier1: javan; supplier1 p-n: LM324D (ST); Footprint Patch: NKH_IC.PcbLib
U5 = 74HC595 SMD: 8 Bit Shift Register with Output Latches (3 STATE); manufacture: Nexperia USA Inc; manufacture p-n: 74HC595D; value: max 6 V min 2 V ,8bit; LIBRARY PATCH: NKH_IC.SchLib; Rahkaran: ‎1012300064; Published: 8-Jun-2000; LatestRevisionDate: 13-Apr-2006; LatestRevisionNote: IPC-7351 Footprint Added.; DatasheetVersion: Apr-1993; PackageVersion: May-1998; PackageReference: SO16; Publisher: Altium Limited; PackageDescription: 16-Pin Small Outline Integrated Circuit 1.27 mm Pitch; Code_IPC: SOIC127P600-16; ComponentLink1Description: Manufacturer Link; ComponentLink1URL: http://www.st.com/; ComponentLink2Description: Datasheet; ComponentLink2URL: http://www.st.com/stonline/products/literature/ds/1989/m74hc595.pdf; part: 74HC595 SMD; case: SO-16; supplier1: javan; supplier1 p-n: 74HC595D; Footprint Patch: NKH_IC.PcbLib
U6 = 74HC4051D,653: 1 Circuit IC Switch 8:1 120Ohm 16-SO; MF: Nexperia USA; Value: *; Price: None; Purchase-URL: https://pricing.snapeda.com/search/part/74HC4051D,653/?ref=eda; Package: SO16-16 Nexperia USA Inc.; MP: 74HC4051D,653; Availability: Good; Check_prices: https://www.snapeda.com/parts/74HC4051D,653/Nexperia/view-part/1737238/?ref=eda; SnapEDA_Link: https://www.snapeda.com/parts/74HC4051D,653/Nexperia/view-part/1737238/?ref=snap
U8 = ESP8266-12E/ESP-12E: This WiFi module has a 32-bit MCU micro and clock speeds supporting 80 MHz or 160 MHz. Supports the RTOS and integrated Wi-Fi MAC/BB/RF/PA/LNA, and has an on-board antenna.; manufacture: Espressif Systems; MF: AI-Thinker; LIBRARY PATCH: NKH_IC.SchLib; Rahkaran: ‎1011900593; Price: None; Package: None; Value: *; MP: ESP8266-12E/ESP-12E; Availability: Unavailable; SnapEDA_Link: https://www.snapeda.com/parts/ESP8266-12E/ESP-12E/AI-Thinker/view-part/106414/?ref=snap; part: ESP8266-12E/ESP-12E; manufacture p-n: ESP8266; supplier1: javan; supplier1 p-n: ESP8266; Footprint Patch: NKH_IC.PcbLib
U9 = ULN2803_SMD: High-Voltage, High-Current Darlington Array; manufacture: Toshiba Corporation; manufacture p-n: MC34063ACD; value: 50v,500mA; LIBRARY PATCH: NKH_IC.SchLib; Rahkaran: ‎1012301758; Published: 13-Oct-2000; LatestRevisionDate: 13-Apr-2006; LatestRevisionNote: IPC-7351 Footprint Added.; DatasheetVersion: 1999; PackageReference: LW18; Publisher: Altium Limited; PackageDescription: 18-Pin Small Outline Integrated Circuit 1.27 mm Pitch; Code_JEDEC: MS-013-AB; ComponentLink1Description: Manufacturer Link; ComponentLink1URL: http://www.allegromicro.com/; part: ULN2803_SMD; case: SOW-18; supplier1: javan; supplier1 p-n: MC34063ACD; Footprint Patch: NKH_IC.PcbLib
VR? = LM2576-DIP: LM2576_adjustable output_7-60V Input_3A; manufacture: TI; LIBRARY PATCH: NKH_IC.SchLib; Rahkaran: 1012300093; part: LM2576-DIP; case: TO-220-5; manufacture p-n: LM2576; supplier1: javan; supplier1 p-n: LM2576-ADJ; Footprint Patch: NKH_IC.PcbLib; value: output_7-60V Input_3A
Q2 Q3 = 2N7002: Value: *